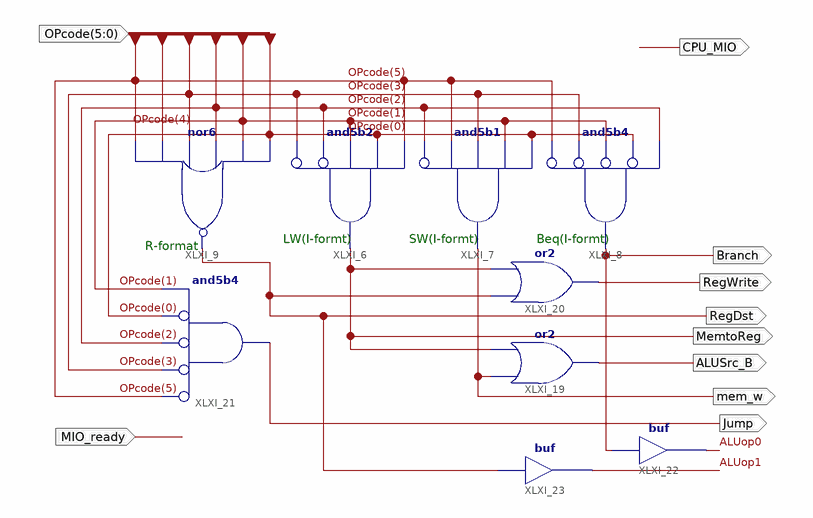
[diagram p0: schematic sheet 1]
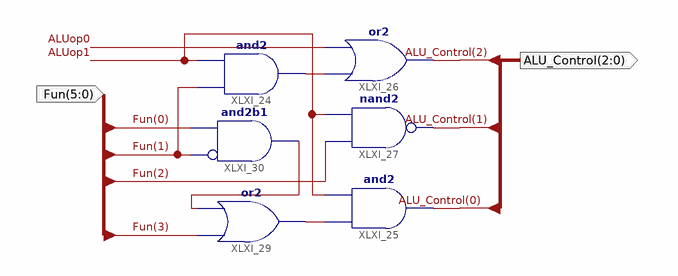
[diagram p1: schematic sheet 2]
// Xilinx ISE schematic SCtrl.sch (kintex7) as structural Verilog: 15 symbols, 12 ports
module SCtrl (
  input  [5:0] OPcode,
  input  MIO_ready,
  input  [5:0] Fun,
  output RegDst,
  output MemtoReg,
  output ALUSrc_B,
  output RegWrite,
  output Branch,
  output mem_w,
  output Jump,
  output CPU_MIO,
  output [2:0] ALU_Control
);

  wire ALUop0, ALUop1, XLXN_255, XLXN_266, XLXN_372;

  and XLXI_6 (MemtoReg, ~OPcode[3], ~OPcode[2], OPcode[1], OPcode[0], OPcode[5]);  // and5b2
  nor XLXI_9 (RegDst, OPcode[5], OPcode[4], OPcode[3], OPcode[2], OPcode[1], OPcode[0]);
  and XLXI_7 (mem_w, ~OPcode[2], OPcode[5], OPcode[3], OPcode[1], OPcode[0]);  // and5b1
  and XLXI_8 (Branch, ~OPcode[5], ~OPcode[3], ~OPcode[1], ~OPcode[0], OPcode[2]);  // and5b4
  or XLXI_19 (ALUSrc_B, mem_w, MemtoReg);
  or XLXI_20 (RegWrite, RegDst, MemtoReg);
  and XLXI_21 (Jump, ~OPcode[5], ~OPcode[3], ~OPcode[2], ~OPcode[0], OPcode[1]);  // and5b4
  buf XLXI_22 (ALUop0, Branch);
  buf XLXI_23 (ALUop1, RegDst);
  and XLXI_25 (ALU_Control[0], XLXN_266, ALUop1);
  nand XLXI_27 (ALU_Control[1], Fun[2], ALUop1);
  and XLXI_24 (XLXN_255, Fun[1], ALUop1);
  or XLXI_26 (ALU_Control[2], XLXN_255, ALUop0);
  and XLXI_30 (XLXN_372, ~Fun[1], Fun[0]);  // and2b1
  or XLXI_29 (XLXN_266, Fun[3], XLXN_372);

  // Notes on the sheet:
  //   R-format
  //   LW(I-formt)
  //   SW(I-formt)
  //   Beq(I-formt)
endmodule
